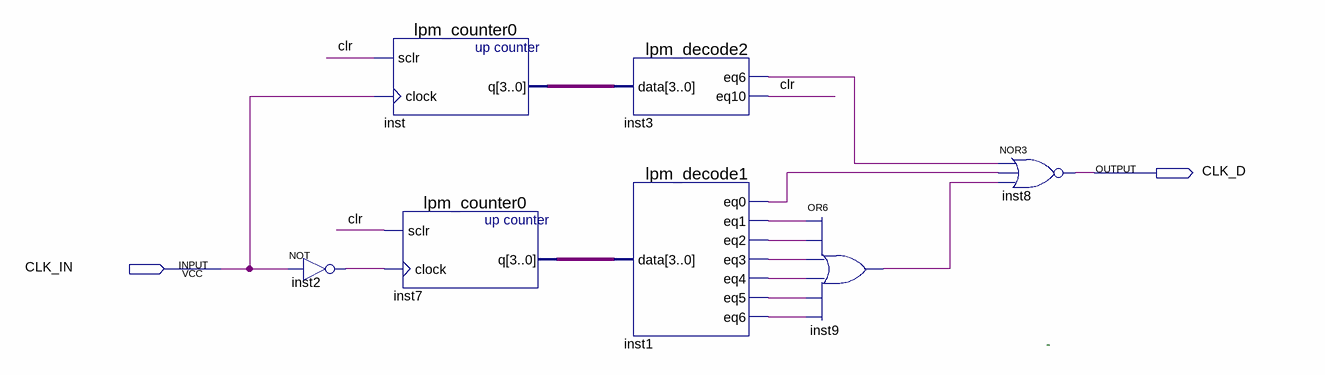
[diagram p0: schematic sheet]
// Quartus schematic Block_2.bdf as structural Verilog: 7 symbols, 2 pins
module Block_2 (
  input  CLK_IN,
  output CLK_D
);

  wire clr, inst1_eq0, inst1_eq1, inst1_eq2, inst1_eq3, inst1_eq4, inst1_eq5, inst1_eq6, inst2_out,
       inst3_eq6, inst9_out;
  wire [3:0] inst7_q, inst_q;

  not inst2 (inst2_out, CLK_IN);
  lpm_counter0 inst (.sclr(clr), .clock(CLK_IN), .q(inst_q));
  lpm_counter0 inst7 (.sclr(clr), .clock(inst2_out), .q(inst7_q));
  lpm_decode2 inst3 (.data(inst_q), .eq6(inst3_eq6), .eq10(clr));
  lpm_decode1 inst1 (
    .data(inst7_q), .eq0(inst1_eq0), .eq1(inst1_eq1), .eq2(inst1_eq2), .eq3(inst1_eq3), .eq4(inst1_eq4),
    .eq5(inst1_eq5), .eq6(inst1_eq6));
  or inst9 (inst9_out, inst1_eq1, inst1_eq2, inst1_eq3, inst1_eq4, inst1_eq5, inst1_eq6);
  nor inst8 (CLK_D, inst3_eq6, inst1_eq0, inst9_out);

  // Notes on the sheet:
  //   -
endmodule
